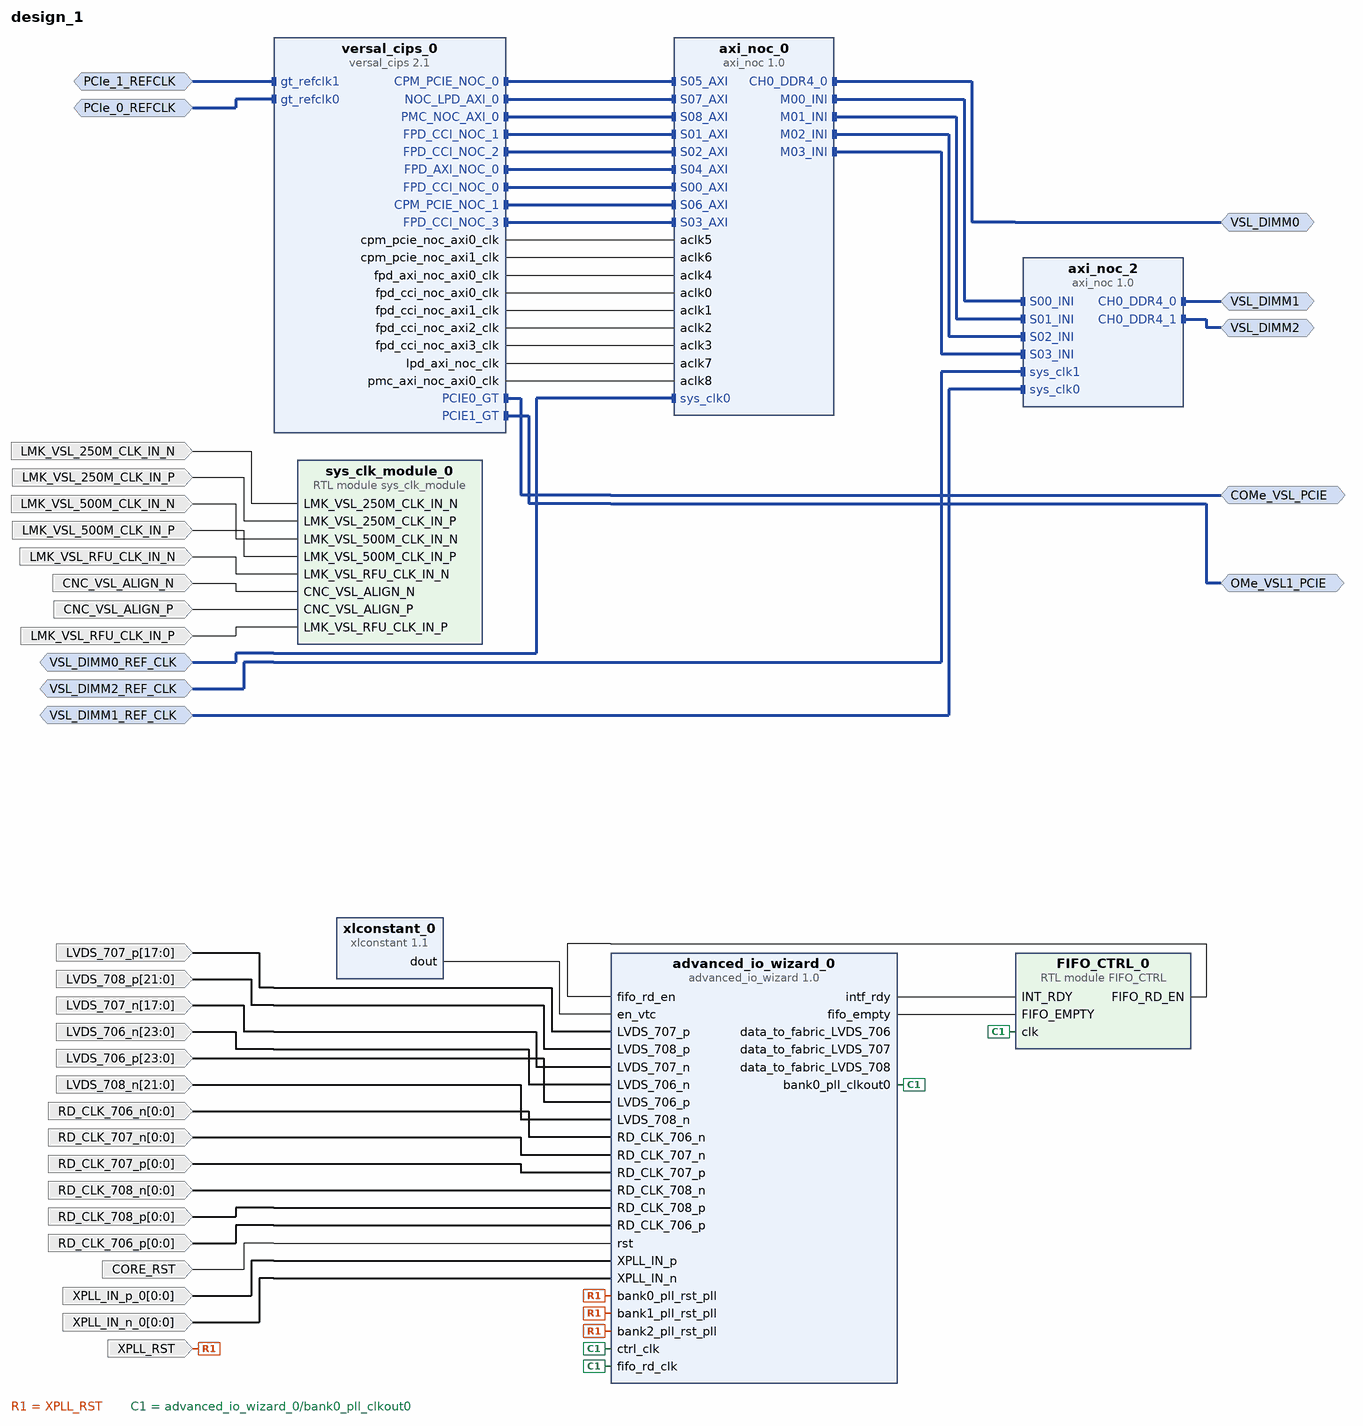
[diagram p0: block diagram of the top level]
# Vivado block design design_1, xcvc1802-vsva2197-2MP-e-S, Vivado 2020.3
create_bd_design design_1

create_bd_intf_port -mode Master -vlnv xilinx.com:interface:ddr4_rtl:1.0 VSL_DIMM0
create_bd_intf_port -mode Slave -vlnv xilinx.com:interface:diff_clock_rtl:1.0 VSL_DIMM0_REF_CLK
set_property -dict {CONFIG.FREQ_HZ 250000000} [get_bd_intf_ports VSL_DIMM0_REF_CLK]
create_bd_intf_port -mode Master -vlnv xilinx.com:interface:gt_rtl:1.0 COMe_VSL_PCIE
create_bd_intf_port -mode Slave -vlnv xilinx.com:interface:diff_clock_rtl:1.0 PCIe_0_REFCLK
create_bd_intf_port -mode Slave -vlnv xilinx.com:interface:diff_clock_rtl:1.0 VSL_DIMM1_REF_CLK
set_property -dict {CONFIG.FREQ_HZ 250000000} [get_bd_intf_ports VSL_DIMM1_REF_CLK]
create_bd_intf_port -mode Slave -vlnv xilinx.com:interface:diff_clock_rtl:1.0 VSL_DIMM2_REF_CLK
set_property -dict {CONFIG.FREQ_HZ 250000000} [get_bd_intf_ports VSL_DIMM2_REF_CLK]
create_bd_intf_port -mode Master -vlnv xilinx.com:interface:ddr4_rtl:1.0 VSL_DIMM1
create_bd_intf_port -mode Master -vlnv xilinx.com:interface:ddr4_rtl:1.0 VSL_DIMM2
create_bd_intf_port -mode Slave -vlnv xilinx.com:interface:diff_clock_rtl:1.0 PCIe_1_REFCLK
create_bd_intf_port -mode Master -vlnv xilinx.com:interface:gt_rtl:1.0 OMe_VSL1_PCIE
create_bd_port -dir I LMK_VSL_250M_CLK_IN_N
create_bd_port -dir I LMK_VSL_250M_CLK_IN_P
create_bd_port -dir I LMK_VSL_500M_CLK_IN_N
create_bd_port -dir I LMK_VSL_500M_CLK_IN_P
create_bd_port -dir I LMK_VSL_RFU_CLK_IN_N
create_bd_port -dir I CNC_VSL_ALIGN_N
create_bd_port -dir I CNC_VSL_ALIGN_P
create_bd_port -dir I LMK_VSL_RFU_CLK_IN_P
create_bd_port -dir I -from 17 -to 0 LVDS_707_p
create_bd_port -dir I -from 21 -to 0 LVDS_708_p
create_bd_port -dir I -from 17 -to 0 LVDS_707_n
create_bd_port -dir I -from 23 -to 0 LVDS_706_n
create_bd_port -dir I -from 23 -to 0 LVDS_706_p
create_bd_port -dir I -from 21 -to 0 LVDS_708_n
create_bd_port -dir I -from 0 -to 0 RD_CLK_706_n
create_bd_port -dir I -from 0 -to 0 RD_CLK_707_n
create_bd_port -dir I -from 0 -to 0 RD_CLK_707_p
create_bd_port -dir I -from 0 -to 0 RD_CLK_708_n
create_bd_port -dir I -from 0 -to 0 RD_CLK_708_p
create_bd_port -dir I -from 0 -to 0 RD_CLK_706_p
create_bd_port -dir I -type rst CORE_RST
set_property -dict {CONFIG.POLARITY ACTIVE_HIGH} [get_bd_ports CORE_RST]
create_bd_port -dir I XPLL_RST
create_bd_port -dir I -from 0 -to 0 XPLL_IN_p_0
create_bd_port -dir I -from 0 -to 0 XPLL_IN_n_0

create_bd_cell -type ip -vlnv xilinx.com:ip:axi_noc:1.0 axi_noc_0
set_property -dict [list \
  CONFIG.MC0_CONFIG_NUM config17 \
  CONFIG.MC0_FLIPPED_PINOUT true \
  CONFIG.MC1_CONFIG_NUM config17 \
  CONFIG.MC2_CONFIG_NUM config17 \
  CONFIG.MC3_CONFIG_NUM config17 \
  CONFIG.MC_CASLATENCY 21 \
  CONFIG.MC_CHAN_REGION1 DDR_LOW1 \
  CONFIG.MC_COMPONENT_WIDTH x8 \
  CONFIG.MC_CONFIG_NUM config17 \
  CONFIG.MC_CS_WIDTH 2 \
  CONFIG.MC_DATAWIDTH 72 \
  CONFIG.MC_DDR4_2T Disable \
  CONFIG.MC_DM_WIDTH 9 \
  CONFIG.MC_DQS_WIDTH 9 \
  CONFIG.MC_DQ_WIDTH 72 \
  CONFIG.MC_ECC_SCRUB_PERIOD 0x0035BC \
  CONFIG.MC_ECC_SCRUB_SIZE 16384 \
  CONFIG.MC_F1_LPDDR4_MR1 0x0000 \
  CONFIG.MC_F1_LPDDR4_MR2 0x0000 \
  CONFIG.MC_F1_LPDDR4_MR3 0x0000 \
  CONFIG.MC_F1_LPDDR4_MR13 0x0000 \
  CONFIG.MC_F1_TFAW 21000 \
  CONFIG.MC_F1_TFAWMIN 21000 \
  CONFIG.MC_F1_TRCD 13750 \
  CONFIG.MC_F1_TRCDMIN 13750 \
  CONFIG.MC_F1_TRRD_L 8 \
  CONFIG.MC_F1_TRRD_L_MIN 8 \
  CONFIG.MC_F1_TRRD_S 4 \
  CONFIG.MC_F1_TRRD_S_MIN 4 \
  CONFIG.MC_INIT_MEM_USING_ECC_SCRUB true \
  CONFIG.MC_INPUTCLK0_PERIOD 3998 \
  CONFIG.MC_MEMORY_DEVICETYPE UDIMMs \
  CONFIG.MC_MEMORY_SPEEDGRADE {DDR4-3200AA(22-22-22)} \
  CONFIG.MC_MEMORY_TIMEPERIOD0 727 \
  CONFIG.MC_RANK 2 \
  CONFIG.MC_TCCD_L 7 \
  CONFIG.MC_TCKE 7 \
  CONFIG.MC_TCKEMIN 7 \
  CONFIG.MC_TFAW 21000 \
  CONFIG.MC_TFAWMIN 21000 \
  CONFIG.MC_TRC 45750 \
  CONFIG.MC_TRCD 13750 \
  CONFIG.MC_TRP 13750 \
  CONFIG.MC_TRPMIN 13750 \
  CONFIG.MC_TRRD_L 7 \
  CONFIG.MC_TRRD_S 4 \
  CONFIG.MC_TRRD_S_MIN 4 \
  CONFIG.MC_TXP 9 \
  CONFIG.MC_TXPMIN 9 \
  CONFIG.MC_TXPR 496 \
  CONFIG.MC_USER_DEFINED_ADDRESS_MAP 1CS-16RA-2BA-2BG-10CA \
  CONFIG.MC_WRITE_BANDWIDTH 5502.0635 \
  CONFIG.MC_XPLL_CLKOUT1_PERIOD 1454 \
  CONFIG.MC_XPLL_CLKOUT1_PHASE 255.26822558459423 \
  CONFIG.NUM_CLKS 9 \
  CONFIG.NUM_MC 1 \
  CONFIG.NUM_MCP 4 \
  CONFIG.NUM_MI 0 \
  CONFIG.NUM_NMI 4 \
  CONFIG.NUM_NSI 0 \
  CONFIG.NUM_SI 9 \
] [get_bd_cells axi_noc_0]
create_bd_cell -type ip -vlnv xilinx.com:ip:versal_cips:2.1 versal_cips_0
set_property -dict [list \
  CONFIG.CPM_PCIE0_MAX_LINK_SPEED 16.0_GT/s \
  CONFIG.CPM_PCIE0_MODES DMA \
  CONFIG.CPM_PCIE0_PF0_BAR2_XDMA_ENABLED 0 \
  CONFIG.CPM_PCIE0_PF0_MSI_ENABLED 0 \
  CONFIG.CPM_PCIE0_PL_LINK_CAP_MAX_LINK_WIDTH X8 \
  CONFIG.CPM_PCIE1_MAX_LINK_SPEED 16.0_GT/s \
  CONFIG.CPM_PCIE1_MODES PCIE \
  CONFIG.CPM_PCIE1_PL_LINK_CAP_MAX_LINK_WIDTH X8 \
  CONFIG.PMC_BANK_1_IO_STANDARD LVCMOS3.3 \
  CONFIG.PMC_QSPI_GRP_FBCLK_ENABLE 1 \
  CONFIG.PMC_QSPI_PERIPHERAL_DATA_MODE x4 \
  CONFIG.PMC_QSPI_PERIPHERAL_ENABLE 1 \
  CONFIG.PMC_QSPI_PERIPHERAL_MODE {Dual Parallel} \
  CONFIG.PMC_SD1_DATA_TRANSFER_MODE 8Bit \
  CONFIG.PMC_SD1_GRP_RESET_ENABLE 1 \
  CONFIG.PMC_SD1_PERIPHERAL_ENABLE 1 \
  CONFIG.PMC_SD1_PERIPHERAL_IO {PMC_MIO 26 .. 36} \
  CONFIG.PMC_SD1_SLOT_TYPE eMMC \
  CONFIG.PMC_USE_PMC_NOC_AXI0 1 \
  CONFIG.PS_ENET0_GRP_MDIO_ENABLE 1 \
  CONFIG.PS_ENET0_GRP_MDIO_IO {PS_MIO 24 .. 25} \
  CONFIG.PS_ENET0_PERIPHERAL_ENABLE 1 \
  CONFIG.PS_ENET0_PERIPHERAL_IO {PS_MIO 0 .. 11} \
  CONFIG.PS_ENET1_PERIPHERAL_ENABLE 0 \
  CONFIG.PS_GPIO_EMIO_PERIPHERAL_ENABLE 0 \
  CONFIG.PS_I2C0_PERIPHERAL_ENABLE 1 \
  CONFIG.PS_I2C0_PERIPHERAL_IO {PMC_MIO 46 .. 47} \
  CONFIG.PS_I2C1_PERIPHERAL_ENABLE 1 \
  CONFIG.PS_I2C1_PERIPHERAL_IO {PMC_MIO 44 .. 45} \
  CONFIG.PS_MIO_12_USAGE Unassigned \
  CONFIG.PS_PCIE_EP_RESET1_IO {PMC_MIO 38} \
  CONFIG.PS_PCIE_EP_RESET2_IO {PMC_MIO 39} \
  CONFIG.PS_PCIE_RESET_ENABLE 1 \
  CONFIG.PS_UART0_PERIPHERAL_ENABLE 1 \
  CONFIG.PS_UART0_PERIPHERAL_IO {PMC_MIO 42 .. 43} \
  CONFIG.PS_UART1_PERIPHERAL_ENABLE 0 \
  CONFIG.PS_USB3_PERIPHERAL_ENABLE 1 \
  CONFIG.PS_USE_PS_NOC_CCI 1 \
  CONFIG.PS_USE_PS_NOC_NCI_0 1 \
  CONFIG.PS_USE_PS_NOC_NCI_1 0 \
  CONFIG.PS_USE_PS_NOC_RPU_0 1 \
  CONFIG.SUBPRESET1 simple_temperature_monitoring \
] [get_bd_cells versal_cips_0]
create_bd_cell -type ip -vlnv xilinx.com:ip:axi_noc:1.0 axi_noc_2
set_property -dict [list \
  CONFIG.MC0_CONFIG_NUM config17 \
  CONFIG.MC0_FLIPPED_PINOUT true \
  CONFIG.MC1_CONFIG_NUM config17 \
  CONFIG.MC1_FLIPPED_PINOUT true \
  CONFIG.MC2_CONFIG_NUM config17 \
  CONFIG.MC3_CONFIG_NUM config17 \
  CONFIG.MC_CASLATENCY 21 \
  CONFIG.MC_CHAN_REGION0 DDR_CH1 \
  CONFIG.MC_COMPONENT_WIDTH x8 \
  CONFIG.MC_CONFIG_NUM config17 \
  CONFIG.MC_CS_WIDTH 2 \
  CONFIG.MC_DATAWIDTH 72 \
  CONFIG.MC_DDR4_2T Disable \
  CONFIG.MC_DM_WIDTH 9 \
  CONFIG.MC_DQS_WIDTH 9 \
  CONFIG.MC_DQ_WIDTH 72 \
  CONFIG.MC_ECC_SCRUB_PERIOD 0x0035BC \
  CONFIG.MC_ECC_SCRUB_SIZE 16384 \
  CONFIG.MC_F1_LPDDR4_MR1 0x0000 \
  CONFIG.MC_F1_LPDDR4_MR2 0x0000 \
  CONFIG.MC_F1_LPDDR4_MR3 0x0000 \
  CONFIG.MC_F1_LPDDR4_MR13 0x0000 \
  CONFIG.MC_F1_TFAW 21000 \
  CONFIG.MC_F1_TFAWMIN 21000 \
  CONFIG.MC_F1_TRCD 13750 \
  CONFIG.MC_F1_TRCDMIN 13750 \
  CONFIG.MC_F1_TRRD_L 8 \
  CONFIG.MC_F1_TRRD_L_MIN 8 \
  CONFIG.MC_F1_TRRD_S 4 \
  CONFIG.MC_F1_TRRD_S_MIN 4 \
  CONFIG.MC_INIT_MEM_USING_ECC_SCRUB true \
  CONFIG.MC_INPUTCLK0_PERIOD 3998 \
  CONFIG.MC_MEMORY_DEVICETYPE UDIMMs \
  CONFIG.MC_MEMORY_SPEEDGRADE {DDR4-3200AA(22-22-22)} \
  CONFIG.MC_MEMORY_TIMEPERIOD0 727 \
  CONFIG.MC_RANK 2 \
  CONFIG.MC_TCCD_L 7 \
  CONFIG.MC_TCKE 7 \
  CONFIG.MC_TCKEMIN 7 \
  CONFIG.MC_TFAW 21000 \
  CONFIG.MC_TFAWMIN 21000 \
  CONFIG.MC_TRC 45750 \
  CONFIG.MC_TRCD 13750 \
  CONFIG.MC_TRP 13750 \
  CONFIG.MC_TRPMIN 13750 \
  CONFIG.MC_TRRD_L 7 \
  CONFIG.MC_TRRD_S 4 \
  CONFIG.MC_TRRD_S_MIN 4 \
  CONFIG.MC_TXP 9 \
  CONFIG.MC_TXPMIN 9 \
  CONFIG.MC_TXPR 496 \
  CONFIG.MC_USER_DEFINED_ADDRESS_MAP 1CS-16RA-2BA-2BG-10CA \
  CONFIG.MC_WRITE_BANDWIDTH 5502.0635 \
  CONFIG.MC_XPLL_CLKOUT1_PERIOD 1454 \
  CONFIG.MC_XPLL_CLKOUT1_PHASE 255.26822558459423 \
  CONFIG.NUM_CLKS 0 \
  CONFIG.NUM_MC 2 \
  CONFIG.NUM_MCP 4 \
  CONFIG.NUM_MI 0 \
  CONFIG.NUM_NSI 4 \
  CONFIG.NUM_SI 0 \
] [get_bd_cells axi_noc_2]
create_bd_cell -type ip -vlnv xilinx.com:ip:advanced_io_wizard:1.0 advanced_io_wizard_0
set_property -dict [list \
  CONFIG.BUS0_DIR RX \
  CONFIG.BUS0_IO_TYPE DIFF \
  CONFIG.BUS0_NUM_PINS 24 \
  CONFIG.BUS0_SIG_NAME LVDS_706 \
  CONFIG.BUS0_STROBE_IO_TYPE DIFF \
  CONFIG.BUS0_STROBE_NAME RD_CLK_706 \
  CONFIG.BUS1_DIR RX \
  CONFIG.BUS1_IO_TYPE DIFF \
  CONFIG.BUS1_NUM_PINS 18 \
  CONFIG.BUS1_SIG_NAME LVDS_707 \
  CONFIG.BUS1_STROBE_IO_TYPE DIFF \
  CONFIG.BUS1_STROBE_NAME RD_CLK_707 \
  CONFIG.BUS2_DIR RX \
  CONFIG.BUS2_IO_TYPE DIFF \
  CONFIG.BUS2_NUM_PINS 22 \
  CONFIG.BUS2_SIG_NAME LVDS_708 \
  CONFIG.BUS2_STROBE_IO_TYPE DIFF \
  CONFIG.BUS2_STROBE_NAME RD_CLK_708 \
  CONFIG.BUS3_DIR RX \
  CONFIG.BUS3_IO_TYPE DIFF \
  CONFIG.BUS3_SIG_NAME XPLL_IN \
  CONFIG.BUS3_SIG_TYPE {Input Clock} \
  CONFIG.DIFFERENTIAL_IO_TERMINATION TERM_100 \
  CONFIG.DIFF_IO_STD LVDS15 \
  CONFIG.DIFF_IO_T DIFF_TERM_ADV \
  CONFIG.ENABLE_PLLOUT1 0 \
  CONFIG.EN_REFCLK_STROBE 0 \
  CONFIG.INPUT_CLK_FREQ 250.000 \
  CONFIG.MAX_BANKS 3 \
  CONFIG.PLL_CLK_SOURCE IBUF_TO_PLL \
  CONFIG.REDUCE_CONTROL_SIG_EN 1 \
  CONFIG.RX_SERIALIZATION_FACTOR 4 \
] [get_bd_cells advanced_io_wizard_0]
create_bd_cell -type ip -vlnv xilinx.com:ip:xlconstant:1.1 xlconstant_0
set_property -dict {CONFIG.CONST_VAL 1} [get_bd_cells xlconstant_0]
create_bd_cell -type module -reference sys_clk_module sys_clk_module_0
create_bd_cell -type module -reference FIFO_CTRL FIFO_CTRL_0

# ---- connections ----

connect_bd_intf_net [get_bd_intf_pins axi_noc_0/S05_AXI] [get_bd_intf_pins versal_cips_0/CPM_PCIE_NOC_0]
connect_bd_intf_net [get_bd_intf_pins axi_noc_0/S07_AXI] [get_bd_intf_pins versal_cips_0/NOC_LPD_AXI_0]
connect_bd_intf_net [get_bd_intf_ports VSL_DIMM0] [get_bd_intf_pins axi_noc_0/CH0_DDR4_0]
connect_bd_intf_net -intf_net gt_refclk1_0_1 [get_bd_intf_ports PCIe_1_REFCLK] [get_bd_intf_pins versal_cips_0/gt_refclk1]
connect_bd_intf_net [get_bd_intf_pins axi_noc_0/S08_AXI] [get_bd_intf_pins versal_cips_0/PMC_NOC_AXI_0]
connect_bd_intf_net [get_bd_intf_pins axi_noc_0/S01_AXI] [get_bd_intf_pins versal_cips_0/FPD_CCI_NOC_1]
connect_bd_intf_net [get_bd_intf_pins axi_noc_0/S02_AXI] [get_bd_intf_pins versal_cips_0/FPD_CCI_NOC_2]
connect_bd_intf_net [get_bd_intf_ports VSL_DIMM2] [get_bd_intf_pins axi_noc_2/CH0_DDR4_1]
connect_bd_intf_net [get_bd_intf_pins axi_noc_0/M00_INI] [get_bd_intf_pins axi_noc_2/S00_INI]
connect_bd_intf_net [get_bd_intf_ports COMe_VSL_PCIE] [get_bd_intf_pins versal_cips_0/PCIE0_GT]
connect_bd_intf_net [get_bd_intf_pins axi_noc_0/S04_AXI] [get_bd_intf_pins versal_cips_0/FPD_AXI_NOC_0]
connect_bd_intf_net -intf_net sys_clk1_0_1 [get_bd_intf_ports VSL_DIMM2_REF_CLK] [get_bd_intf_pins axi_noc_2/sys_clk1]
connect_bd_intf_net [get_bd_intf_ports VSL_DIMM1] [get_bd_intf_pins axi_noc_2/CH0_DDR4_0]
connect_bd_intf_net [get_bd_intf_pins axi_noc_0/S00_AXI] [get_bd_intf_pins versal_cips_0/FPD_CCI_NOC_0]
connect_bd_intf_net [get_bd_intf_ports OMe_VSL1_PCIE] [get_bd_intf_pins versal_cips_0/PCIE1_GT]
connect_bd_intf_net -intf_net gt_refclk0_0_1 [get_bd_intf_ports PCIe_0_REFCLK] [get_bd_intf_pins versal_cips_0/gt_refclk0]
connect_bd_intf_net [get_bd_intf_pins axi_noc_0/M01_INI] [get_bd_intf_pins axi_noc_2/S01_INI]
connect_bd_intf_net -intf_net sys_clk0_0_3 [get_bd_intf_ports VSL_DIMM1_REF_CLK] [get_bd_intf_pins axi_noc_2/sys_clk0]
connect_bd_intf_net [get_bd_intf_pins axi_noc_0/S06_AXI] [get_bd_intf_pins versal_cips_0/CPM_PCIE_NOC_1]
connect_bd_intf_net [get_bd_intf_pins axi_noc_0/M02_INI] [get_bd_intf_pins axi_noc_2/S02_INI]
connect_bd_intf_net [get_bd_intf_pins axi_noc_0/S03_AXI] [get_bd_intf_pins versal_cips_0/FPD_CCI_NOC_3]
connect_bd_intf_net -intf_net sys_clk0_0_1 [get_bd_intf_ports VSL_DIMM0_REF_CLK] [get_bd_intf_pins axi_noc_0/sys_clk0]
connect_bd_intf_net [get_bd_intf_pins axi_noc_0/M03_INI] [get_bd_intf_pins axi_noc_2/S03_INI]
connect_bd_net [get_bd_pins versal_cips_0/cpm_pcie_noc_axi0_clk] [get_bd_pins axi_noc_0/aclk5]
connect_bd_net [get_bd_pins versal_cips_0/cpm_pcie_noc_axi1_clk] [get_bd_pins axi_noc_0/aclk6]
connect_bd_net [get_bd_pins versal_cips_0/fpd_axi_noc_axi0_clk] [get_bd_pins axi_noc_0/aclk4]
connect_bd_net [get_bd_pins versal_cips_0/fpd_cci_noc_axi0_clk] [get_bd_pins axi_noc_0/aclk0]
connect_bd_net [get_bd_pins versal_cips_0/fpd_cci_noc_axi1_clk] [get_bd_pins axi_noc_0/aclk1]
connect_bd_net [get_bd_pins versal_cips_0/fpd_cci_noc_axi2_clk] [get_bd_pins axi_noc_0/aclk2]
connect_bd_net [get_bd_pins versal_cips_0/fpd_cci_noc_axi3_clk] [get_bd_pins axi_noc_0/aclk3]
connect_bd_net [get_bd_pins versal_cips_0/lpd_axi_noc_clk] [get_bd_pins axi_noc_0/aclk7]
connect_bd_net [get_bd_pins versal_cips_0/pmc_axi_noc_axi0_clk] [get_bd_pins axi_noc_0/aclk8]
connect_bd_net [get_bd_pins xlconstant_0/dout] [get_bd_pins advanced_io_wizard_0/en_vtc]
connect_bd_net -net LMK_VSL_250M_CLK_IN_N_0_1 [get_bd_ports LMK_VSL_250M_CLK_IN_N] [get_bd_pins sys_clk_module_0/LMK_VSL_250M_CLK_IN_N]
connect_bd_net -net LMK_VSL_250M_CLK_IN_P_0_1 [get_bd_ports LMK_VSL_250M_CLK_IN_P] [get_bd_pins sys_clk_module_0/LMK_VSL_250M_CLK_IN_P]
connect_bd_net -net LMK_VSL_500M_CLK_IN_N_0_1 [get_bd_ports LMK_VSL_500M_CLK_IN_N] [get_bd_pins sys_clk_module_0/LMK_VSL_500M_CLK_IN_N]
connect_bd_net -net LMK_VSL_500M_CLK_IN_P_0_1 [get_bd_ports LMK_VSL_500M_CLK_IN_P] [get_bd_pins sys_clk_module_0/LMK_VSL_500M_CLK_IN_P]
connect_bd_net -net LMK_VSL_RFU_CLK_IN_N_0_1 [get_bd_ports LMK_VSL_RFU_CLK_IN_N] [get_bd_pins sys_clk_module_0/LMK_VSL_RFU_CLK_IN_N]
connect_bd_net -net CNC_VSL_ALIGN_N_0_1 [get_bd_ports CNC_VSL_ALIGN_N] [get_bd_pins sys_clk_module_0/CNC_VSL_ALIGN_N]
connect_bd_net -net CNC_VSL_ALIGN_P_0_1 [get_bd_ports CNC_VSL_ALIGN_P] [get_bd_pins sys_clk_module_0/CNC_VSL_ALIGN_P]
connect_bd_net -net LMK_VSL_RFU_CLK_IN_P_0_1 [get_bd_ports LMK_VSL_RFU_CLK_IN_P] [get_bd_pins sys_clk_module_0/LMK_VSL_RFU_CLK_IN_P]
connect_bd_net -net LVDS_707_p_0_1 [get_bd_ports LVDS_707_p] [get_bd_pins advanced_io_wizard_0/LVDS_707_p]
connect_bd_net -net LVDS_708_p_0_1 [get_bd_ports LVDS_708_p] [get_bd_pins advanced_io_wizard_0/LVDS_708_p]
connect_bd_net -net LVDS_707_n_0_1 [get_bd_ports LVDS_707_n] [get_bd_pins advanced_io_wizard_0/LVDS_707_n]
connect_bd_net -net LVDS_706_n_0_1 [get_bd_ports LVDS_706_n] [get_bd_pins advanced_io_wizard_0/LVDS_706_n]
connect_bd_net -net LVDS_706_p_0_1 [get_bd_ports LVDS_706_p] [get_bd_pins advanced_io_wizard_0/LVDS_706_p]
connect_bd_net -net LVDS_708_n_0_1 [get_bd_ports LVDS_708_n] [get_bd_pins advanced_io_wizard_0/LVDS_708_n]
connect_bd_net -net RD_CLK_706_n_0_1 [get_bd_ports RD_CLK_706_n] [get_bd_pins advanced_io_wizard_0/RD_CLK_706_n]
connect_bd_net -net RD_CLK_707_n_0_1 [get_bd_ports RD_CLK_707_n] [get_bd_pins advanced_io_wizard_0/RD_CLK_707_n]
connect_bd_net -net RD_CLK_707_p_0_1 [get_bd_ports RD_CLK_707_p] [get_bd_pins advanced_io_wizard_0/RD_CLK_707_p]
connect_bd_net -net RD_CLK_708_n_0_1 [get_bd_ports RD_CLK_708_n] [get_bd_pins advanced_io_wizard_0/RD_CLK_708_n]
connect_bd_net -net RD_CLK_708_p_0_1 [get_bd_ports RD_CLK_708_p] [get_bd_pins advanced_io_wizard_0/RD_CLK_708_p]
connect_bd_net -net RD_CLK_706_p_0_1 [get_bd_ports RD_CLK_706_p] [get_bd_pins advanced_io_wizard_0/RD_CLK_706_p]
connect_bd_net -net rst_0_1 [get_bd_ports CORE_RST] [get_bd_pins advanced_io_wizard_0/rst]
connect_bd_net [get_bd_ports XPLL_RST] \
  [get_bd_pins advanced_io_wizard_0/bank2_pll_rst_pll] [get_bd_pins advanced_io_wizard_0/bank1_pll_rst_pll] \
  [get_bd_pins advanced_io_wizard_0/bank0_pll_rst_pll]
connect_bd_net [get_bd_pins advanced_io_wizard_0/intf_rdy] [get_bd_pins FIFO_CTRL_0/INT_RDY]
connect_bd_net [get_bd_pins advanced_io_wizard_0/fifo_empty] [get_bd_pins FIFO_CTRL_0/FIFO_EMPTY]
connect_bd_net [get_bd_pins FIFO_CTRL_0/FIFO_RD_EN] [get_bd_pins advanced_io_wizard_0/fifo_rd_en]
connect_bd_net [get_bd_pins advanced_io_wizard_0/bank0_pll_clkout0] \
  [get_bd_pins FIFO_CTRL_0/clk] [get_bd_pins advanced_io_wizard_0/fifo_rd_clk] [get_bd_pins advanced_io_wizard_0/ctrl_clk]
# net data_to_fabric_LVDS_706 has one end: advanced_io_wizard_0/data_to_fabric_LVDS_706
# net data_to_fabric_LVDS_707 has one end: advanced_io_wizard_0/data_to_fabric_LVDS_707
# net data_to_fabric_LVDS_708 has one end: advanced_io_wizard_0/data_to_fabric_LVDS_708
connect_bd_net -net XPLL_IN_p_0_1 [get_bd_ports XPLL_IN_p_0] [get_bd_pins advanced_io_wizard_0/XPLL_IN_p]
connect_bd_net -net XPLL_IN_n_0_1 [get_bd_ports XPLL_IN_n_0] [get_bd_pins advanced_io_wizard_0/XPLL_IN_n]
set_property HDL_ATTRIBUTE.DEBUG true [get_bd_nets data_to_fabric_LVDS_706]
set_property HDL_ATTRIBUTE.MARK_DEBUG true [get_bd_nets data_to_fabric_LVDS_706]
set_property HDL_ATTRIBUTE.DEBUG true [get_bd_nets data_to_fabric_LVDS_707]
set_property HDL_ATTRIBUTE.MARK_DEBUG true [get_bd_nets data_to_fabric_LVDS_707]
set_property HDL_ATTRIBUTE.DEBUG true [get_bd_nets data_to_fabric_LVDS_708]
set_property HDL_ATTRIBUTE.MARK_DEBUG true [get_bd_nets data_to_fabric_LVDS_708]

# ---- address map ----
assign_bd_address -offset 0x0000000000000000 -range 2G -target_address_space [get_bd_addr_spaces versal_cips_0/DATA_CCI0] [get_bd_addr_segs axi_noc_0/S00_AXI/C0_DDR_LOW0]
assign_bd_address -offset 0x0000000800000000 -range 4G -target_address_space [get_bd_addr_spaces versal_cips_0/DATA_CCI0] [get_bd_addr_segs axi_noc_0/S00_AXI/C0_DDR_LOW1]
assign_bd_address -offset 0x0000050000000000 -range 8G -target_address_space [get_bd_addr_spaces versal_cips_0/DATA_CCI0] [get_bd_addr_segs axi_noc_2/S00_INI/C0_DDR_CH1x2]
assign_bd_address -offset 0x0000000000000000 -range 2G -target_address_space [get_bd_addr_spaces versal_cips_0/DATA_CCI1] [get_bd_addr_segs axi_noc_0/S01_AXI/C1_DDR_LOW0]
assign_bd_address -offset 0x0000000800000000 -range 4G -target_address_space [get_bd_addr_spaces versal_cips_0/DATA_CCI1] [get_bd_addr_segs axi_noc_0/S01_AXI/C1_DDR_LOW1]
assign_bd_address -offset 0x0000050000000000 -range 8G -target_address_space [get_bd_addr_spaces versal_cips_0/DATA_CCI1] [get_bd_addr_segs axi_noc_2/S01_INI/C1_DDR_CH1x2]
assign_bd_address -offset 0x0000000000000000 -range 2G -target_address_space [get_bd_addr_spaces versal_cips_0/DATA_CCI2] [get_bd_addr_segs axi_noc_0/S02_AXI/C2_DDR_LOW0]
assign_bd_address -offset 0x0000000800000000 -range 4G -target_address_space [get_bd_addr_spaces versal_cips_0/DATA_CCI2] [get_bd_addr_segs axi_noc_0/S02_AXI/C2_DDR_LOW1]
assign_bd_address -offset 0x0000050000000000 -range 8G -target_address_space [get_bd_addr_spaces versal_cips_0/DATA_CCI2] [get_bd_addr_segs axi_noc_2/S02_INI/C2_DDR_CH1x2]
assign_bd_address -offset 0x0000000000000000 -range 2G -target_address_space [get_bd_addr_spaces versal_cips_0/DATA_CCI3] [get_bd_addr_segs axi_noc_0/S03_AXI/C3_DDR_LOW0]
assign_bd_address -offset 0x0000000800000000 -range 4G -target_address_space [get_bd_addr_spaces versal_cips_0/DATA_CCI3] [get_bd_addr_segs axi_noc_0/S03_AXI/C3_DDR_LOW1]
assign_bd_address -offset 0x0000050000000000 -range 8G -target_address_space [get_bd_addr_spaces versal_cips_0/DATA_CCI3] [get_bd_addr_segs axi_noc_2/S03_INI/C3_DDR_CH1x2]
assign_bd_address -offset 0x50000000000 -range 8G -target_address_space [get_bd_addr_spaces versal_cips_0/DATA_NCI0] [get_bd_addr_segs axi_noc_2/S00_INI/C0_DDR_CH1x2]
assign_bd_address -offset 0x50000000000 -range 8G -target_address_space [get_bd_addr_spaces versal_cips_0/DATA_PCIE0] [get_bd_addr_segs axi_noc_2/S00_INI/C0_DDR_CH1x2]
assign_bd_address -offset 0x50000000000 -range 8G -target_address_space [get_bd_addr_spaces versal_cips_0/DATA_PCIE1] [get_bd_addr_segs axi_noc_2/S00_INI/C0_DDR_CH1x2]
assign_bd_address -offset 0x50000000000 -range 8G -target_address_space [get_bd_addr_spaces versal_cips_0/DATA_PMC] [get_bd_addr_segs axi_noc_2/S00_INI/C0_DDR_CH1x2]
assign_bd_address -offset 0x50000000000 -range 8G -target_address_space [get_bd_addr_spaces versal_cips_0/DATA_RPU0] [get_bd_addr_segs axi_noc_2/S00_INI/C0_DDR_CH1x2]

validate_bd_design
save_bd_design
